# EAGLE schematic 18500_pack_v2 (EAGLE 9.6.2)
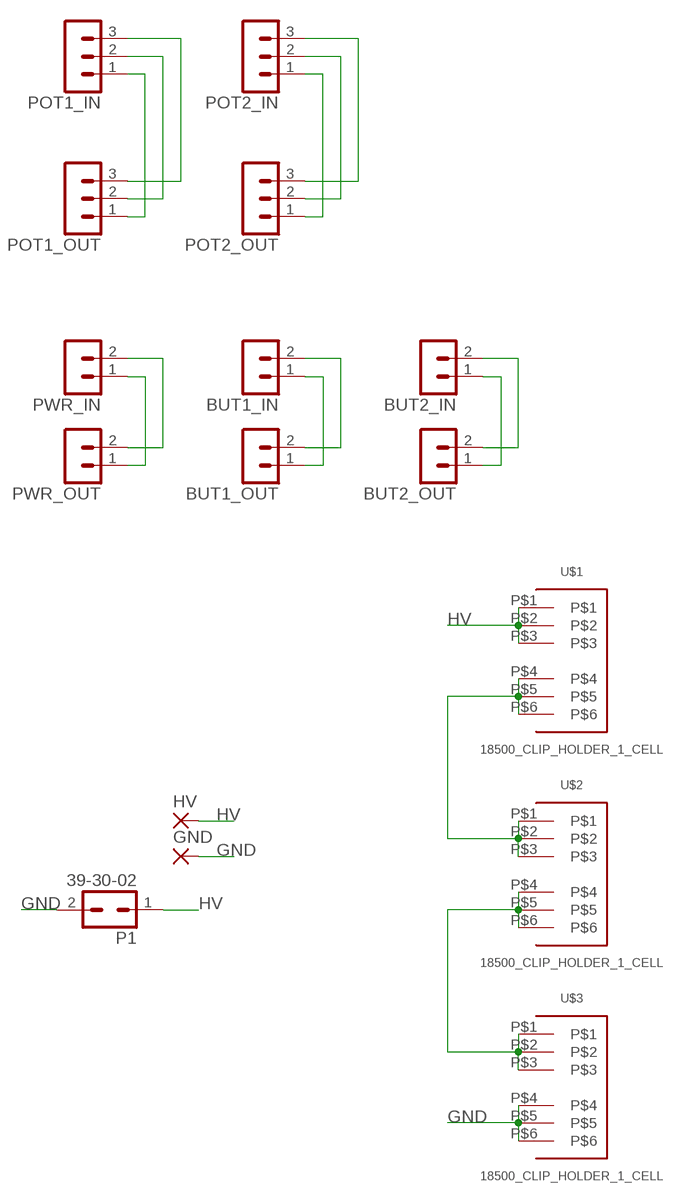
[diagram p0: schematic, sheet 1]

## Parts
BUT1_IN  B2B-PH-K  [B2B-PH-K]
BUT1_OUT  B2B-PH-K  [B2B-PH-K]
BUT2_IN  B2B-PH-K  [B2B-PH-K]
BUT2_OUT  B2B-PH-K  [B2B-PH-K]
GND  2,54/1,1  [2,54/1,1]
HV  2,54/1,1  [2,54/1,1]
P1  39-30-02  [39-30-?02?]
POT1_IN  B3B-PH-K  [B3B-PH-K]
POT1_OUT  B3B-PH-K  [B3B-PH-K]
POT2_IN  B3B-PH-K  [B3B-PH-K]
POT2_OUT  B3B-PH-K  [B3B-PH-K]
PWR_IN  B2B-PH-K  [B2B-PH-K]
PWR_OUT  B2B-PH-K  [B2B-PH-K]
U$1  18500_CLIP_HOLDER_1_CELL  [3PINBATTERY_CLIP_1_CELL_18500]
U$2  18500_CLIP_HOLDER_1_CELL  [3PINBATTERY_CLIP_1_CELL_18500]
U$3  18500_CLIP_HOLDER_1_CELL  [3PINBATTERY_CLIP_1_CELL_18500]

## Nets
GND: GND.1(P) P1.2 U$3.P$4 U$3.P$5 U$3.P$6
HV: HV.1(P) P1.1 U$1.P$1 U$1.P$2 U$1.P$3
N$1: U$1.P$4 U$1.P$5 U$1.P$6 U$2.P$1 U$2.P$2 U$2.P$3
N$2: U$2.P$4 U$2.P$5 U$2.P$6 U$3.P$1 U$3.P$2 U$3.P$3
N$3: PWR_IN.2 PWR_OUT.2
N$4: PWR_IN.1 PWR_OUT.1
N$5: BUT1_IN.2 BUT1_OUT.2
N$6: BUT1_IN.1 BUT1_OUT.1
N$7: BUT2_IN.2 BUT2_OUT.2
N$8: BUT2_IN.1 BUT2_OUT.1
N$9: POT1_IN.1 POT1_OUT.1
N$10: POT1_IN.2 POT1_OUT.2
N$11: POT1_IN.3 POT1_OUT.3
N$12: POT2_IN.1 POT2_OUT.1
N$13: POT2_IN.2 POT2_OUT.2
N$14: POT2_IN.3 POT2_OUT.3

## Library data of the parts
BUT1_IN BUT1_OUT BUT2_IN BUT2_OUT PWR_IN PWR_OUT = con-jst-ph:B2B-PH-K: HEADER
GND HV = wirepad:2,54/1,1: THROUGH-HOLE PAD
P1 = con-molex-mini-fit:39-30-?02?: HEADER
POT1_IN POT1_OUT POT2_IN POT2_OUT = con-jst-ph:B3B-PH-K: HEADER
U$1-U$3 = nathans-custom-parts:18500_CLIP_HOLDER_1_CELL